# EAGLE schematic Power_Supply_Circuit_Manual (EAGLE 9.3.0)
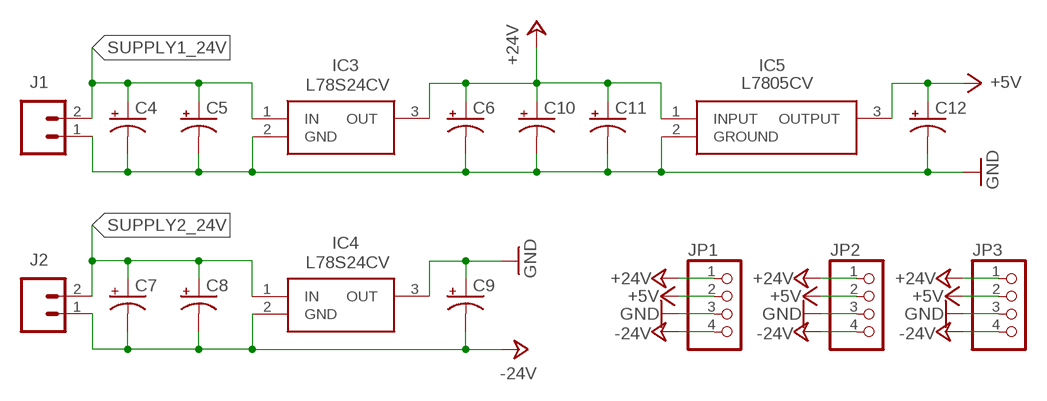
[diagram p0: schematic, sheet 1]

## Parts
C4  CPOL-USE2.5-7  [E2,5-7]
C5  CPOL-USE2.5-7  [E2,5-7]
C6  CPOL-USE2.5-5  [E2,5-5]
C7  CPOL-USE2.5-7  [E2,5-7]
C8  CPOL-USE2.5-7  [E2,5-7]
C9  CPOL-USE2.5-5  [E2,5-5]
C10  CPOL-USE2.5-7  [E2,5-7]
C11  CPOL-USE2.5-7  [E2,5-7]
C12  CPOL-USE2.5-5  [E2,5-5]
IC3  L78S24CV  [TO270P460X1020X2008-3P]
IC4  L78S24CV  [TO270P460X1020X2008-3P]
IC5  L7805CV  [TO270P460X1020X2008-3P]
J1  CONN_025MM  [SCREWTERMINAL-5MM-2]
J2  CONN_025MM  [SCREWTERMINAL-5MM-2]
JP1  PINHD-1X4  [1X04]
JP2  PINHD-1X4  [1X04]
JP3  PINHD-1X4  [1X04]

## Nets
+5V: C12.+ IC5.3(OUTPUT) JP1.2 JP2.2 JP3.2
+24V: C6.+ C10.+ C11.+ IC3.3(OUT) IC5.1(INPUT) JP1.1 JP2.1 JP3.1
-24V: C7.- C8.- C9.- IC4.2(GND) J2.1 JP1.4 JP2.4 JP3.4
GND: C4.- C5.- C6.- C9.+ C10.- C11.- C12.- IC3.2(GND) IC4.3(OUT) IC5.2(GROUND) J1.1 JP1.3 JP2.3 JP3.3
SUPPLY1_24V: C4.+ C5.+ IC3.1(IN) J1.2
SUPPLY2_24V: C7.+ C8.+ IC4.1(IN) J2.2

## Library data of the parts
C4-C12 = rcl:CPOL-US: POLARIZED CAPACITOR, American symbol; SPICEPREFIX: C
IC3 IC4 = SamacSys_Parts:L78S24CV: L78S24CV, Voltage Regulator, 2A 24 V, 3-Pin TO-220 Source: Datasheet <https://componentsearchengine.com/Datasheets/1/L78S24CV.pdf>; DESCRIPTION: L78S24CV, Voltage Regulator, 2A 24 V, 3-Pin TO-220; HEIGHT: 4.6mm; MANUFACTURER_NAME: STMicroelectronics; MANUFACTURER_PART_NUMBER: L78S24CV; MOUSER_PART_NUMBER: 511-L78S24CV
IC5 = SamacSys_Parts:L7805CV: Linear voltage regulator,L7805CV 5V 1.5A STMicroelectronics L7805CV, Single Linear Voltage Regulator, 1.5A 5 V, 3-Pin TO-220 Source: Datasheet <https://componentsearchengine.com/Datasheets/1/L7805CV.pdf>; DESCRIPTION: Linear voltage regulator,L7805CV 5V 1.5A STMicroelectronics L7805CV, Single Linear Voltage Regulator, 1.5A 5 V, 3-Pin TO-220; HEIGHT: 4.6mm; MANUFACTURER_NAME: STMicroelectronics; MANUFACTURER_PART_NUMBER: L7805CV; MOUSER_PART_NUMBER: 511-L7805CV
J1 J2 = SparkFun-Connectors:CONN_02: Multi connection point. Often used as Generic Header-pin footprint for 0.1 inch spaced/style header connections On any of the 0.1 inch spaced packages, you can populate with these: Break Away Headers - Straight <https://www.sparkfun.com/products/116> (PRT-00116) Break Away Male Headers - Right Angle <https://www.sparkfun.com/products/553> (PRT-00553) Female Headers <https://www.sparkfun.com/products/115> (PRT-00115) Break Away Headers - Machine Pin <https://www.sparkfun.com/products/117> (PRT-00117) Break Away Female Headers - Swiss Machine Pin <https://www.sparkfun.com/products/743> (PRT-00743) For SCREWTERMINALS and SPRING TERMINALS visit here: Screw Terimnals on SparkFun.com <https://www.sparkfun.com/search/results?term=Screw+Terminals> (5mm/3.5mm/2.54mm spacing) This device is also useful as a general connection point to wire up your design to another part of your project. Our various solder wires solder well into these plated through hole pads. Hook-Up Wire - Assortment (Stranded, 22 AWG) <https://www.sparkfun.com/products/11375> (PRT-11375) Hook-Up Wire - Assortment (Solid Core, 22 AWG) <https://www.sparkfun.com/products/11367> (PRT-11367) View the entire wire category on our website here <https://www.sparkfun.com/categories/141> Special notes: Molex polarized connector foot print use with: PRT-08233 with associated crimp pins and housings. 2.54_SCREWTERM for use with PRT-10571. 3.5mm Screw Terminal footprints for PRT-08084 5mm Screw Terminal footprints for use with PRT-08432; SF_SKU: PRT-08432
JP1-JP3 = pinhead:PINHD-1X4: PIN HEADER

## Net classes
0 default: width 0.305 mm, drill 0.508 mm, clearance 0.254 mm